# Altium schematic sheet Microcontroller.SchDoc
size A4; SheetNumber: 5; SheetTotal: 8
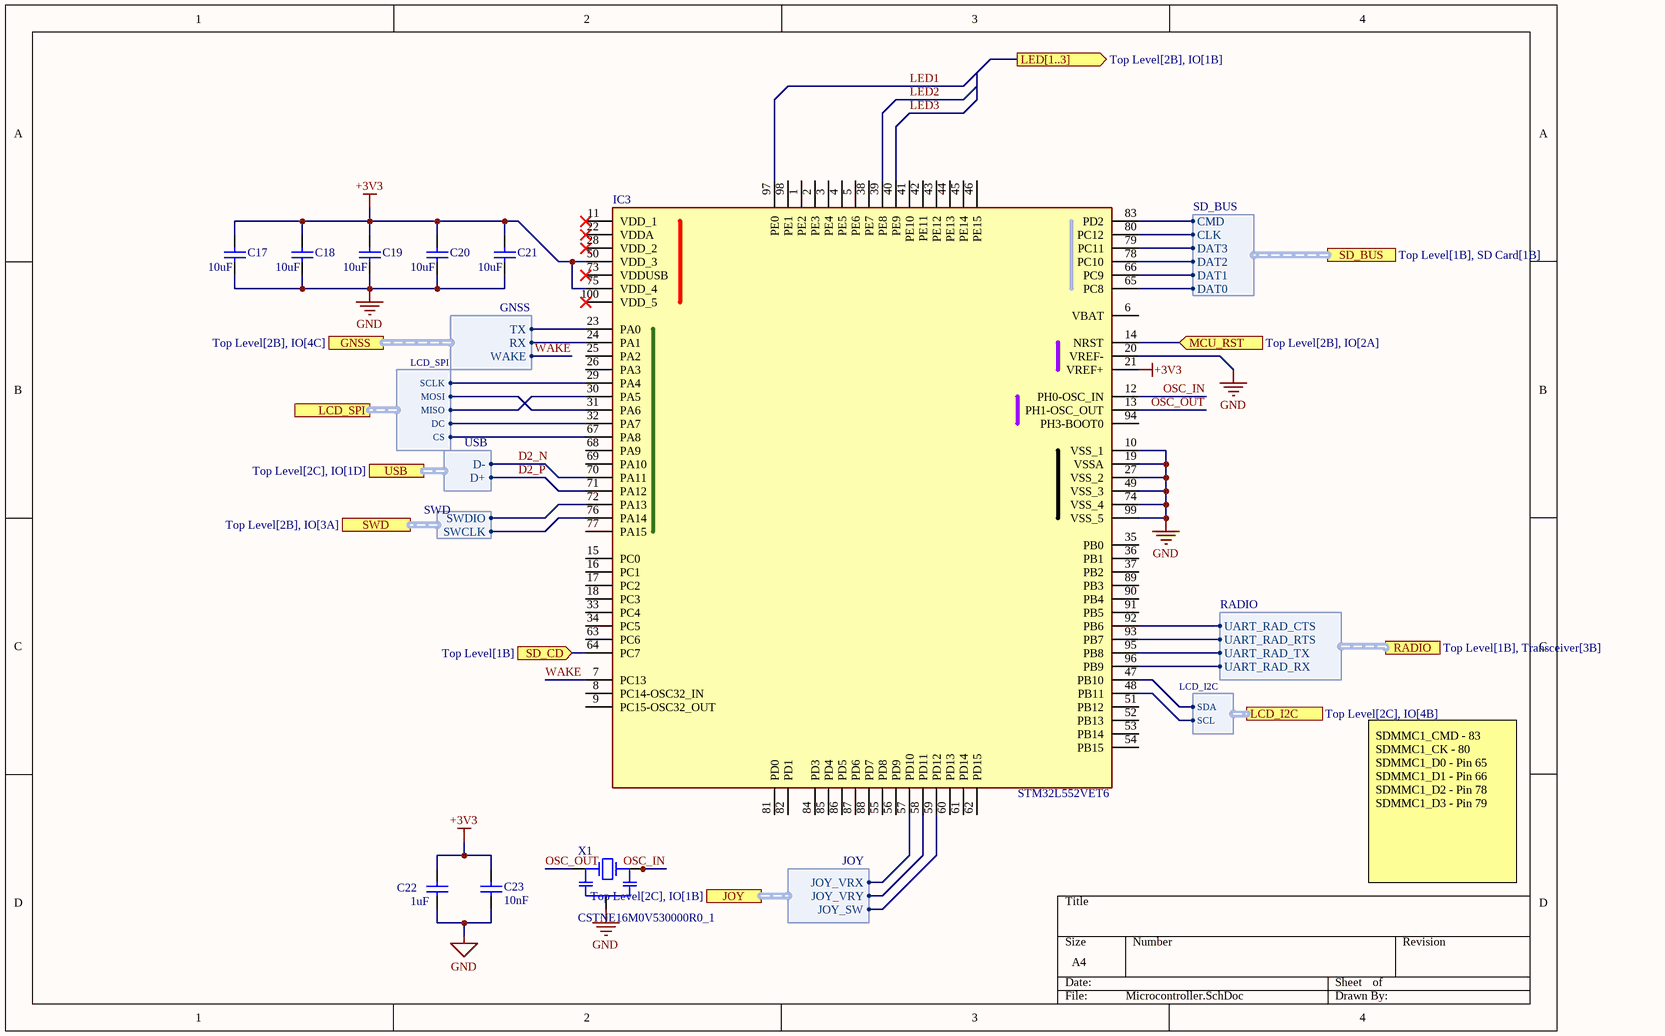
[diagram p0: Microcontroller.SchDoc]

## Parts
C17  value 10uF  [CAPC2012X14N]  (hidden comment: C0805C106K8PACTU)
C18  value 10uF  [CAPC2012X14N]  (hidden comment: C0805C106K8PACTU)
C19  value 10uF  [CAPC2012X14N]  (hidden comment: C0805C106K8PACTU)
C20  value 10uF  [CAPC2012X14N]  (hidden comment: C0805C106K8PACTU)
C21  value 10uF  [CAPC2012X14N]  (hidden comment: C0805C106K8PACTU)
C22  value 1uF  [CAPC1608X10N]  (hidden comment: C0603C105K8PACTU)
C23  value 10nF  [CAPC1608X10N]  (hidden comment: C0603C103J5RACTU)
IC3  STM32L552VET6  [QFP50P1600X1600X160-100N]
X1  CSTNE16M0V530000R0_1  [FP-CSTNE16M0V530000R0-MFG]

## Ports
GNSS (harness GNSS, see Top Level[2B], IO[4C]), JOY (harness JOY, see Top Level[2C], IO[1B]), LCD_I2C (harness LCD_I2C, see Top Level[2C], IO[4B]), LCD_SPI (harness LCD_SPI, see Top Level[2C], IO[4A]), LED[1..3] (out, see Top Level[2B], IO[1B]), MCU_RST (in, see Top Level[2B], IO[2A]), RADIO (harness RADIO, see Top Level[1B], Transceiver[3B]), SD_BUS (harness SD_BUS, see Top Level[1B], SD Card[1B]), SD_CD (in, see Top Level[1B]), SWD (harness SWD, see Top Level[2B], IO[3A]), USB (harness USB, see Top Level[2C], IO[1D])

## Harnesses
SD_BUS: CLK, CMD, DAT0, DAT1, DAT2, DAT3
SWD: SWCLK, SWDIO
RADIO: UART_RAD_CTS, UART_RAD_RTS, UART_RAD_TX, UART_RAD_RX
GNSS: RX, TX, WAKE
JOY: JOY_VRX, JOY_VRY, JOY_SW
USB: D+, D-
LCD_I2C: SCL, SDA
LCD_SPI: SCLK, MOSI, MISO, DC, CS

## Nets
+3V3: C17.2 C18.2 C19.2 C20.2 C21.2 C22.2 C23.2 IC3.21(VREF+) IC3.50(VDD_3) IC3.75(VDD_4)
GND: C17.1 C18.1 C19.1 C20.1 C21.1 C22.1 C23.1 IC3.10(VSS_1) IC3.19(VSSA) IC3.20(VREF-) IC3.27(VSS_2) IC3.49(VSS_3) IC3.74(VSS_4) IC3.99(VSS_5) X1.2(GND)
D2_N: IC3.70(PA11) ; port USB.D-
D2_P: IC3.71(PA12) ; port USB.D+
LED1: IC3.97(PE0)
LED2: IC3.39(PE8)
LED3: IC3.40(PE9)
MCU_RST: IC3.14(NRST) ; port MCU_RST
OSC_IN: IC3.12(PH0-OSC_IN) X1.3(OUT)
OSC_OUT: IC3.13(PH1-OSC_OUT) X1.1(INPUT)
SD_CD: IC3.64(PC7) ; port SD_CD
WAKE: IC3.7(PC13) ; port GNSS.WAKE
NetIC3_23: IC3.23(PA0) ; port GNSS.TX
NetIC3_24: IC3.24(PA1) ; port GNSS.RX
NetIC3_29: IC3.29(PA4) ; port LCD_SPI.SCLK
NetIC3_30: IC3.30(PA5) ; port LCD_SPI.MISO
NetIC3_31: IC3.31(PA6) ; port LCD_SPI.MOSI
NetIC3_32: IC3.32(PA7) ; port LCD_SPI.DC
NetIC3_47: IC3.47(PB10) ; port LCD_I2C.SDA
NetIC3_48: IC3.48(PB11) ; port LCD_I2C.SCL
NetIC3_57: IC3.57(PD10) ; port JOY.JOY_VRX
NetIC3_58: IC3.58(PD11) ; port JOY.JOY_VRY
NetIC3_59: IC3.59(PD12) ; port JOY.JOY_SW
NetIC3_65: IC3.65(PC8) ; port SD_BUS.DAT0
NetIC3_66: IC3.66(PC9) ; port SD_BUS.DAT1
NetIC3_67: IC3.67(PA8) ; port LCD_SPI.CS
NetIC3_72: IC3.72(PA13) ; port SWD.SWDIO
NetIC3_76: IC3.76(PA14) ; port SWD.SWCLK
NetIC3_78: IC3.78(PC10) ; port SD_BUS.DAT2
NetIC3_79: IC3.79(PC11) ; port SD_BUS.DAT3
NetIC3_80: IC3.80(PC12) ; port SD_BUS.CLK
NetIC3_83: IC3.83(PD2) ; port SD_BUS.CMD
NetIC3_92: IC3.92(PB6) ; port RADIO.UART_RAD_CTS
NetIC3_93: IC3.93(PB7) ; port RADIO.UART_RAD_RTS
NetIC3_95: IC3.95(PB8) ; port RADIO.UART_RAD_TX
NetIC3_96: IC3.96(PB9) ; port RADIO.UART_RAD_RX

Not connected (* = marked no-connect by the designer): IC3 1(PE2) 2(PE3) 3(PE4) 4(PE5) 5(PE6) 6(VBAT) 8(PC14-OSC32_IN) 9(PC15-OSC32_OUT) 11(VDD_1)* 15(PC0) 16(PC1) 17(PC2) 18(PC3) 22(VDDA)* 25(PA2) 26(PA3) 28(VDD_2)* 33(PC4) 34(PC5) 35(PB0) 36(PB1) 37(PB2) 38(PE7) 41(PE10) 42(PE11) 43(PE12) 44(PE13) 45(PE14) 46(PE15) 51(PB12) 52(PB13) 53(PB14) 54(PB15) 55(PD8) 56(PD9) 60(PD13) 61(PD14) 62(PD15) 63(PC6) 68(PA9) 69(PA10) 73(VDDUSB)* 77(PA15) 81(PD0) 82(PD1) 84(PD3) 85(PD4) 86(PD5) 87(PD6) 88(PD7) 89(PB3) 90(PB4) 91(PB5) 94(PH3-BOOT0) 98(PE1) 100(VDD_5)*

## Notes on the sheet
- SDMMC1_CMD - 83
  SDMMC1_CK - 80
  SDMMC1_D0 - Pin 65
  SDMMC1_D1 - Pin 66
  SDMMC1_D2 - Pin 78
  SDMMC1_D3 - Pin 79

## Library data of the parts
C17-C21 = CMP-00046-3: CAP CER 10UF 10V X5R 0805; Dielectric Material: Ceramic; Dissipation Factor: 10%; Width: 1.2mm; Number of Pins: 2; Voltage: 10V; Packaging: Tape and Reel; Dielectric: X5R; Mount: Surface Mount; Case/Package: 0805; Thickness: 0.055inch; Package Quantity: 1; Voltage Rating (DC): 10V; Case Code (Imperial): 0805; Tolerance: 10%; Max Operating Temperature: 85°C; Radiation Hardening: No; Termination: SMD/SMT; Height: 1.25mm; Voltage Rating: 10V; Capacitance: 10uF; Length: 2mm; Min Operating Temperature: -55°C; Depth: 1.25mm; REACH SVHC: No SVHC; Case Code (Metric): 2012; Contact Plating: Tin,Matte; JLC_PN: C15850
C22 = C0603C105K8PACTU: Cap Ceramic 1uF 10V X5R 10% SMD 0603 85°C Paper T/R; Capacitance: 1uF; Voltage Rating (DC): 10V; Case/Package: 0603; Height: 0.8mm; Tolerance: 10%; Width: 0.031inch; Lead Free: Lead Free; Mount: Surface Mount; Length: 1.6mm; Number of Pins: 2; Radiation Hardening: No; Dielectric: X5R; Voltage: 10V; Depth: 0.8mm; Weight: 7.1E-05oz; REACH SVHC: No SVHC; Package Quantity: 1; Max Operating Temperature: 85°C; Case Code (Imperial): 0603; Thickness: 0.035inch; Min Operating Temperature: -55°C; Dielectric Material: Ceramic; Case Code (Metric): 1608; Packaging: Tape and Reel; Voltage Rating: 10V; Termination: SMD/SMT
C23 = CMP-00047-2: Cap Ceramic 0.01uF 50V X7R 5% SMD 0603 125C Paper T/R; Dielectric: X7R; Case/Package: 0603; Height: 0.8mm; Capacitance: 10nF; Depth: 0.8mm; Length: 1.6mm; Min Operating Temperature: -55°C; Radiation Hardening: No; Packaging: Tape and Reel; Max Operating Temperature: 125°C; Mount: Surface Mount; Tolerance: 5%; JLC_PN: C57112
IC3 = STM32L552VET6: Integrated Circuit; Manufacturer_Name: STMicroelectronics; Datasheet Link: https://www.st.com/resource/en/datasheet/stm32l552cc.pdf; Height: 1.6mm; Manufacturer_Part_Number: STM32L552VET6; Mouser Part Number: 511-STM32L552VET6; Mouser Price/Stock: https://www.mouser.co.uk/ProductDetail/STMicroelectronics/STM32L552VET6?qs=%252B6g0mu59x7JvngnoIPuHpg%3D%3D; Arrow Part Number: STM32L552VET6; Arrow Price/Stock: https://www.arrow.com/en/products/stm32l552vet6/stmicroelectronics?region=nac
X1 = CSTNE16M0V530000R0_1: Resonators 16.0 MHZ 15PF; Manufacturer_Name: Murata Electronics; Datasheet Link: https://www.murata.com/products/productdata/8801160822814/SPEC-CSTNE16M0V530000R0.pdf; Height: 1mm; Manufacturer_Part_Number: CSTNE16M0V530000R0; Mouser Part Number: 81-CSTNE16M0V530000R; Mouser Price/Stock: https://www.mouser.co.uk/ProductDetail/Murata-Electronics/CSTNE16M0V530000R0?qs=y6ZabgHbY%252BzQcQICtMt%2F3w%3D%3D; Arrow Part Number: CSTNE16M0V530000R0; Arrow Price/Stock: https://www.arrow.com/en/products/cstne16m0v530000r0/murata-manufacturing?region=nac